# EAGLE design LegoConnectorX2 (EAGLE 9.0.0)
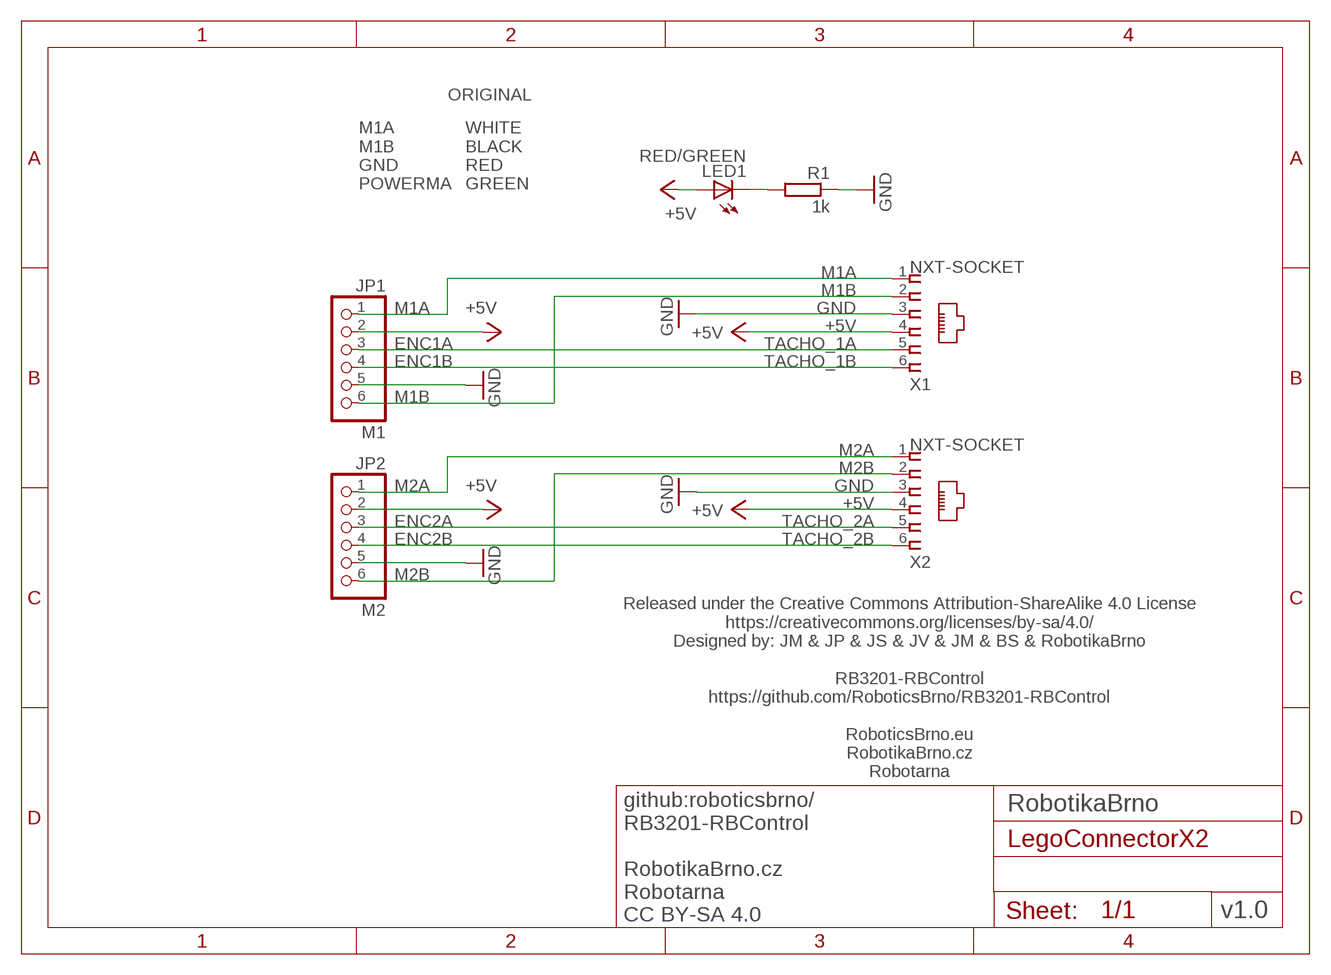
[diagram p0: schematic, sheet 1]

## Parts
JP1  M1  PINHD-1X6  [1X06]
JP2  M2  PINHD-1X6  [1X06]
LED1  RED/GREEN  LEDSML0603  [SML0603]
R1  1k  R-EU_R0603  [R0603]
X1  NXT-SOCKET  [NXT-SOCKET]
X2  NXT-SOCKET  [NXT-SOCKET]

## Nets
+5V: JP1.2 JP2.2 LED1.A X1.4 X2.4
GND: JP1.5 JP2.5 R1.1 X1.3 X2.3
M1A: JP1.1 X1.1
M1B: JP1.6 X1.2
M2A: JP2.1 X2.1
M2B: JP2.6 X2.2
N$3: LED1.C R1.2
TACHO_1A: JP1.3 X1.5
TACHO_1B: JP1.4 X1.6
TACHO_2A: JP2.3 X2.5
TACHO_2B: JP2.4 X2.6

## Notes on the sheet
- ORIGINAL
- M1A
  M1B
  GND
  POWERMA
- WHITE
  BLACK
  RED
  GREEN
- ENC1A
- ENC1B
- ENC2A
- ENC2B
- Released under the Creative Commons Attribution-ShareAlike 4.0 License
  https://creativecommons.org/licenses/by-sa/4.0/
  Designed by: JM & JP & JS & JV & JM & BS & RobotikaBrno
  
  RB3201-RBControl
  https://github.com/RoboticsBrno/RB3201-RBControl
  
  RoboticsBrno.eu
  RobotikaBrno.cz
  Robotarna
- RobotikaBrno
- v1.0
- github:roboticsbrno/
  RB3201-RBControl
  
  RobotikaBrno.cz
  Robotarna
  CC BY-SA 4.0

## Library data of the parts
JP1 JP2 = pinhead:PINHD-1X6: PIN HEADER
LED1 = led:LED: LED OSRAM: - CHIPLED LG R971, LG N971, LY N971, LG Q971, LY Q971, LO R971, LY R971 LH N974, LH R974 LS Q976, LO Q976, LY Q976 LO Q996 - Hyper CHIPLED LW Q18S LB Q993, LB Q99A, LB R99A - SideLED LS A670, LO A670, LY A670, LG A670, LP A670 LB A673, LV A673, LT A673, LW A673 LH A674 LY A675 LS A676, LA A676, LO A676, LY A676, LW A676 LS A679, LY A679, LG A679 - Hyper Micro SIDELED® LS Y876, LA Y876, LO Y876, LY Y876 LT Y87S - SmartLED LW L88C, LW L88S LB L89C, LB L89S, LG L890 LS L89K, LO L89K, LY L89K LS L896, LA L896, LO L896, LY L896 - TOPLED LS T670, LO T670, LY T670, LG T670, LP T670 LSG T670, LSP T670, LSY T670, LOP T670, LYG T670 LG T671, LOG T671, LSG T671 LB T673, LV T673, LT T673, LW T673 LH T674 LS T676, LA T676, LO T676, LY T676, LB T676, LH T676, LSB T676, LW T676 LB T67C, LV T67C, LT T67C, LS T67K, LO T67K, LY T67K, LW E67C LS E67B, LA E67B, LO E67B, LY E67B, LB E67C, LV E67C, LT E67C LW T67C LS T679, LY T679, LG T679 LS T770, LO T770, LY T770, LG T770, LP T770 LB T773, LV T773, LT T773, LW T773 LH T774 LS E675, LA E675, LY E675, LS T675 LS T776, LA T776, LO T776, LY T776, LB T776 LHGB T686 LT T68C, LB T68C - Hyper Mini TOPLED® LB M676 - Mini TOPLED Santana® LG M470 LS M47K, LO M47K, LY M47K Source: http://www.osram.convergy.de LUXEON: - LUMILED® LXK2-PW12-R00, LXK2-PW12-S00, LXK2-PW14-U00, LXK2-PW14-V00 LXK2-PM12-R00, LXK2-PM12-S00, LXK2-PM14-U00 LXK2-PE12-Q00, LXK2-PE12-R00, LXK2-PE12-S00, LXK2-PE14-T00, LXK2-PE14-U00 LXK2-PB12-K00, LXK2-PB12-L00, LXK2-PB12-M00, LXK2-PB14-N00, LXK2-PB14-P00, LXK2-PB14-Q00 LXK2-PR12-L00, LXK2-PR12-M00, LXK2-PR14-Q00, LXK2-PR14-R00 LXK2-PD12-Q00, LXK2-PD12-R00, LXK2-PD12-S00 LXK2-PH12-R00, LXK2-PH12-S00 LXK2-PL12-P00, LXK2-PL12-Q00, LXK2-PL12-R00 Source: www.luxeon.com KINGBRIGHT: KA-3528ASYC Source: www.kingbright.com
R1 = rcl:R-EU_: RESISTOR, European symbol
X1 X2 = NXT Compatible (female) Sockets - Mindsensors:NXT-SOCKET: RJ11 6 connects Manufacturer: Mindsensors.com Source: NXT-Female-Socket.pdf; OC_FARNELL: unknown; OC_NEWARK: unknown

## Net classes
0 default: width 0.2 mm, drill 0.35 mm, clearance 0.2 mm

## Board
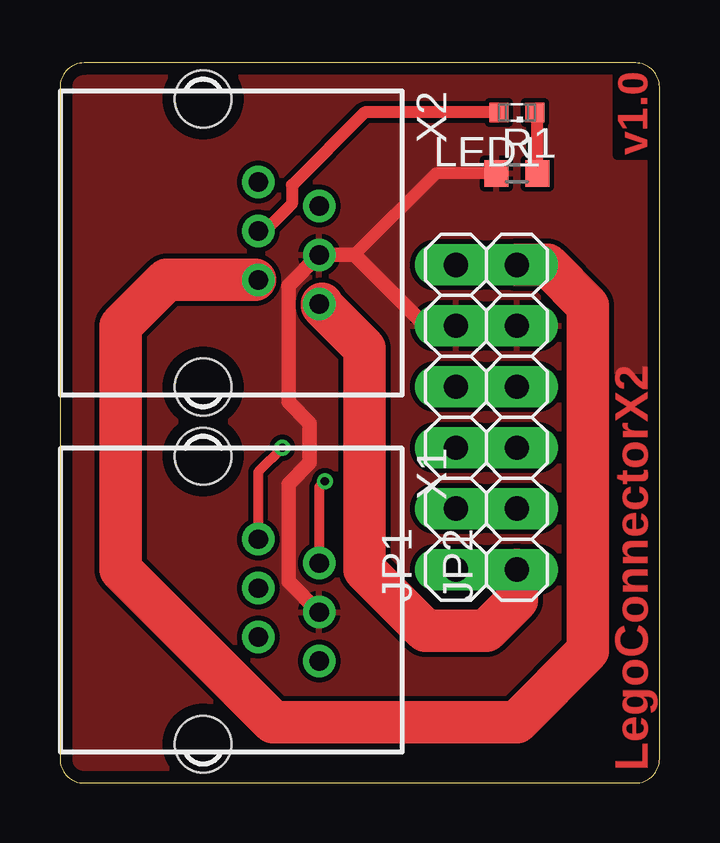
[diagram p1: board, top side]
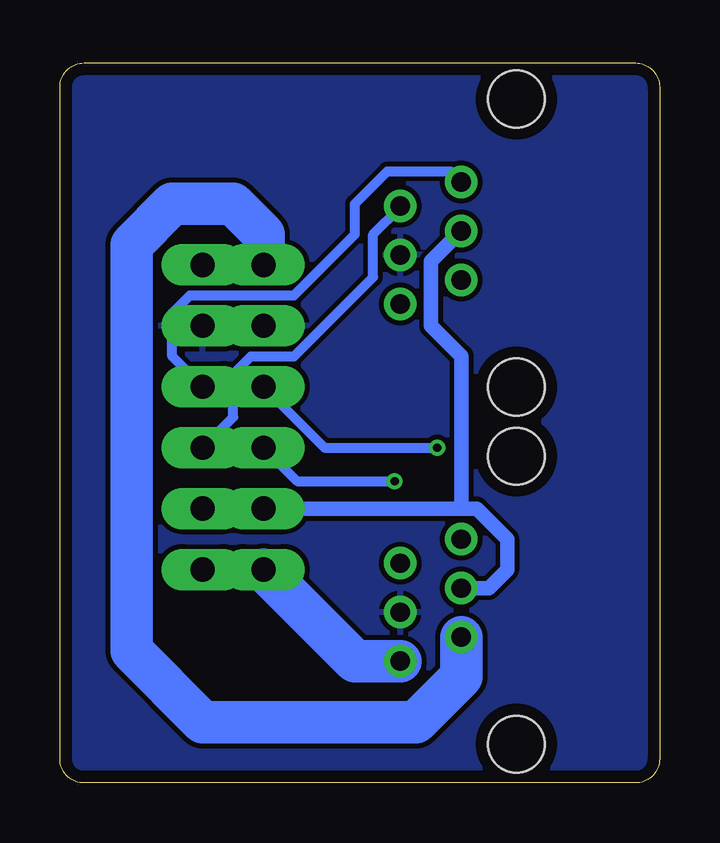
[diagram p2: board, bottom side, seen from below]

Size 25 x 30 mm. Coordinates in mm from the lower left corner, seen from the top.
Outline: 0,29 0,1 arc90 1,0 24,0 arc90 25,1 25,29 arc90 24,30 1,30 arc90 0,29
Copper layers (1*16): Top 0.035mm / dielectric 1.5mm / Bottom 0.035mm
Design rules "robotikabrno": minimum track width 0.2mm, minimum drill 0.35mm, track to track 0.2mm, track to pad 0.2mm, pad to pad 0.2mm, via to via 0.2mm, smd to smd 0.2mm, copper to edge 0.5mm, drill to drill 0.5mm, minimum pad ring 0.16mm, minimum via ring 0.16mm, stop-mask expansion 0.1mm, vias tented up to drill 0.4mm, thermal gap 0.2mm

### Footprints (pad centres in the part's own frame; a part is rotated, then mirrored left to right if it is on the bottom)
1X06 = drill 1.016 long: 1 -6.35,0; 2 -3.81,0; 3 -1.27,0; 4 1.27,0; 5 3.81,0; 6 6.35,0
SML0603 = smd 0.8 x 0.8: A 0.75,0; C -0.75,0
R0603 = smd 1 x 1.1: 1 -0.85,0; 2 0.85,0
NXT-SOCKET = drill 0.8 pad 1.3: 1 2.54,10.809; 2 1.54,8.269; 3 0.5,10.809; 4 -0.5,8.269; 5 -1.54,10.809; 6 -2.54,8.269 | hole 2.36: -6,5.969; 6,5.969

### Placement (x,y rotation side)
JP1  16.51,15.24 90 top
JP2  19.05,15.24 90 top
LED1  19.05,27.94 180 top
R1  19.05,25.4 0 top
X1  0,7.62 270 top
X2  0,22.5 270 top

### Tracks (layer width: path | path; a pad name or v marks a point on that pad's centre or on a via)
+5V
  Top 0.508: LED1.A 12.7,27.94 9.68,24.91 9.68,24.13 8.54,23 X2.4
  Bottom 0.254: JP1.2 JP2.2
  Bottom 0.61: JP2.2 9.53,11.43 | 9.53,11.43 8.26,11.43 | 8.26,11.43 7.62,11.43 6.35,10.16 6.35,8.89 7.12,8.12 X1.4 | 9.53,11.43 9.52,11.43 | X2.4 9.52,21.75 9.52,19.05 8.26,17.78 8.26,11.43
GND
  Top 0.508: R1.1 15.69,25.4 12.29,22
  Top 0.61: JP2.5 JP1.5 15.24,19.05 12.29,22 X2.3 9.53,20.72 9.53,15.88 10.41,14.99 10.41,13.34 9.53,12.45 9.53,8.4 X1.3
  pour Top: 0,0 25.4,0 25.4,30.48 0,30.48
  pour Bottom: 0,0 25.4,0 25.4,30.48 0,30.48
M1A
  Bottom 1.778: JP1.1 12.7,5.08 X1.1
M1B
  Bottom 0.254: JP1.6 16.51,21.61
  Bottom 1.778: X1.2 8.27,4.43 10.16,2.54 19.05,2.54 22.02,5.51 22.02,22.43 20.32,24.13 17.78,24.13 16.51,22.86 16.51,21.61
M2A
  Top 0.254: X2.1 10.85,19.96 10.92,19.89
  Top 1.778: JP2.1 19.05,7.62 17.78,6.35 15.24,6.35 12.7,8.89 12.7,18.11 10.92,19.89 10.92,19.96
M2B
  Top 0.152: X2.2 8.13,20.96
  Top 1.778: JP2.6 20.32,21.59 22.02,19.89 22.02,5.51 19.05,2.54 8.89,2.54 2.54,8.89 2.54,19.05 4.45,20.96 8.13,20.96
N$3
  Top 0.508: R1.2 19.9,27.84 LED1.C
TACHO_1A  (via drill 0.35)
  Top 0.406: v11.05,12.57 10.81,12.33 X1.5
  Bottom 0.406: JP1.3 15.11,12.57 v11.05,12.57
TACHO_1B  (via drill 0.35)
  Top 0.406: v9.27,13.97 8.27,12.97 X1.6
  Bottom 0.406: JP1.4 13.97,13.97 v9.27,13.97
TACHO_2A
  Bottom 0.406: JP2.3 17.78,15.24 17.78,16.51 17.78,17.04 17.03,17.78 15.24,17.78 11.94,21.08 11.94,22.86 10.81,23.99 X2.5
TACHO_2B
  Bottom 0.406: JP2.4 20.32,17.78 20.32,19.57 19.57,20.32 19.05,20.32 17.07,20.32 17.06,20.32 15.24,20.32 12.7,22.86 12.7,24.13 11.35,25.48 8.71,25.48 X2.6

### Text on the board
Top: v1.0 | LegoConnectorX2
tDocu: LED1 / RED | v1.0 | R1 / 1k | MB | - | EB | EA | + | MA | M1 | M2 | RB3201-RBControl / LegoConnectorX2